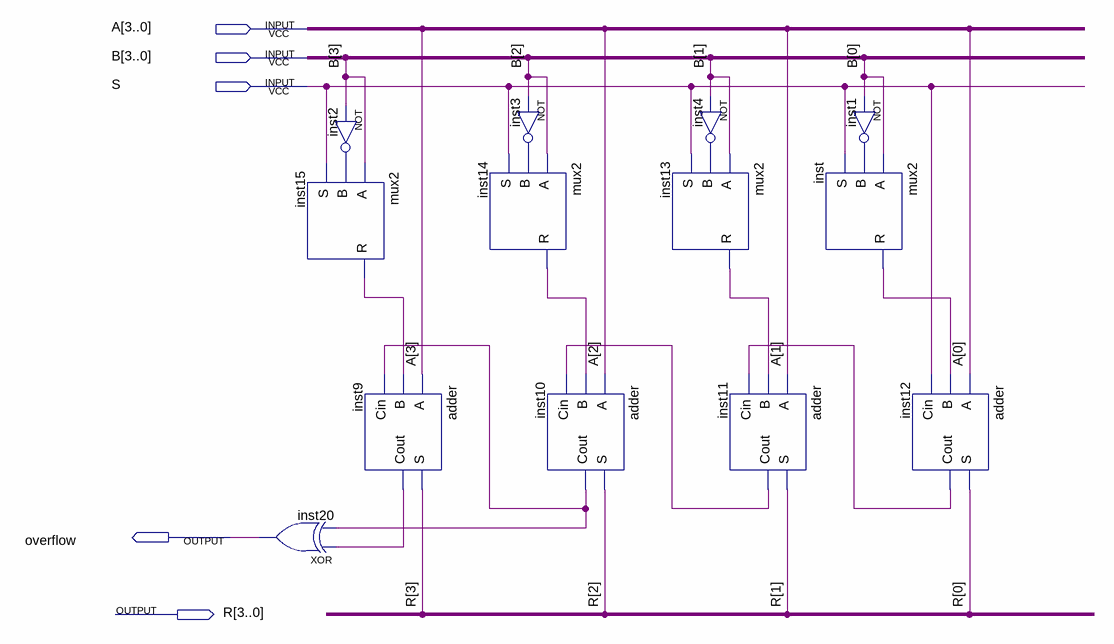
[diagram p0: schematic sheet]
// Quartus schematic somador_subtracter.bdf as structural Verilog: 13 symbols, 5 pins
module somador_subtracter (
  input  [3:0] A,
  input  [3:0] B,
  input  S,
  output overflow,
  output [3:0] R
);

  wire inst1_out, inst2_out, inst3_out, inst4_out, inst9_cout, inst10_cout, inst11_cout, inst12_cout,
       inst13_r, inst14_r, inst15_r, inst_r;

  not inst2 (inst2_out, B[3]);
  mux2 inst15 (.A(B[3]), .B(inst2_out), .S(S), .R(inst15_r));
  xor inst20 (overflow, inst9_cout, inst10_cout);
  adder inst9 (.A(A[3]), .B(inst15_r), .Cin(inst10_cout), .S(R[3]), .Cout(inst9_cout));
  mux2 inst14 (.A(B[2]), .B(inst3_out), .S(S), .R(inst14_r));
  not inst3 (inst3_out, B[2]);
  adder inst10 (.A(A[2]), .B(inst14_r), .Cin(inst11_cout), .S(R[2]), .Cout(inst10_cout));
  not inst4 (inst4_out, B[1]);
  mux2 inst13 (.A(B[1]), .B(inst4_out), .S(S), .R(inst13_r));
  adder inst11 (.A(A[1]), .B(inst13_r), .Cin(inst12_cout), .S(R[1]), .Cout(inst11_cout));
  not inst1 (inst1_out, B[0]);
  mux2 inst (.A(B[0]), .B(inst1_out), .S(S), .R(inst_r));
  adder inst12 (.A(A[0]), .B(inst_r), .Cin(S), .S(R[0]), .Cout(inst12_cout));
endmodule
